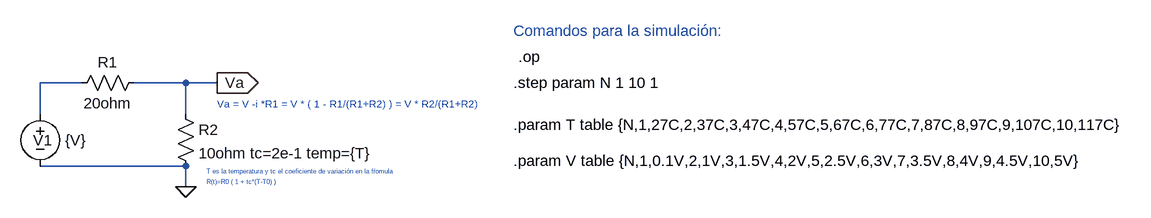
[diagram p0: schematic Resistor_No_Ohmico_Barrido_En_Temperatura.asc]
Resistor_No_Ohmico_Barrido_En_Temperatura.asc, the LTspice schematic file:
Version 4
SHEET 1 1708 680
WIRE 48 64 -16 64
WIRE 208 64 128 64
WIRE 256 64 208 64
WIRE -16 112 -16 64
WIRE 208 112 208 64
WIRE 208 192 -16 192
WIRE 208 224 208 192
FLAG 208 224 0
FLAG 256 64 Va
IOPIN 256 64 Out
SYMBOL voltage -16 96 R0
WINDOW 0 -11 56 Left 2
WINDOW 3 38 56 Left 2
WINDOW 123 0 0 Left 0
WINDOW 39 0 0 Left 0
SYMATTR InstName V1
SYMATTR Value {V}
SYMBOL res 32 80 R270
WINDOW 0 32 56 VTop 2
WINDOW 3 0 56 VBottom 2
SYMATTR InstName R1
SYMATTR Value 20ohm
SYMBOL res 192 96 R0
SYMATTR InstName R2
SYMATTR Value 10ohm tc=2e-1 temp={T}
TEXT 720 24 Left 2 !.op
TEXT 256 96 Left 1 ;Va = V -i *R1 = V * ( 1 - R1/(R1+R2) ) = V * R2/(R1+R2)
TEXT 712 64 Left 2 !.step param N 1 10 1
TEXT 712 128 Left 2 !.param T table {N,1,27C,2,37C,3,47C,4,57C,5,67C,6,77C,7,87C,8,97C,9,107C,10,117C}
TEXT 712 -16 Left 2 ;Comandos para la simulación:
TEXT 240 200 Left 0 ;T es la temperatura y tc el coeficiente de variación en la fŕomula
TEXT 240 216 Left 0 ;R(t)=R0 ( 1 + tc*(T-T0) )
TEXT 712 184 Left 2 !.param V table {N,1,0.1V,2,1V,3,1.5V,4,2V,5,2.5V,6,3V,7,3.5V,8,4V,9,4.5V,10,5V}

The netlist it stands for:
* Resistor_No_Ohmico_Barrido_En_Temperatura.asc
V1 N001 0 {V}
R1 N001 Va 20ohm
R2 Va 0 10ohm tc=2e-1 temp={T}
.op
* Va = V -i *R1 = V * ( 1 - R1/(R1+R2) ) = V * R2/(R1+R2)
.step param N 1 10 1
.param T table {N,1,27C,2,37C,3,47C,4,57C,5,67C,6,77C,7,87C,8,97C,9,107C,10,117C}
* Comandos para la simulación:
* T es la temperatura y tc el coeficiente de variación en la fŕomula
* R(t)=R0 ( 1 + tc*(T-T0) )
.param V table {N,1,0.1V,2,1V,3,1.5V,4,2V,5,2.5V,6,3V,7,3.5V,8,4V,9,4.5V,10,5V}
.backanno
.end